# Altium schematic sheet 电机控制盒.SchDoc
size A4; SheetNumber: 4
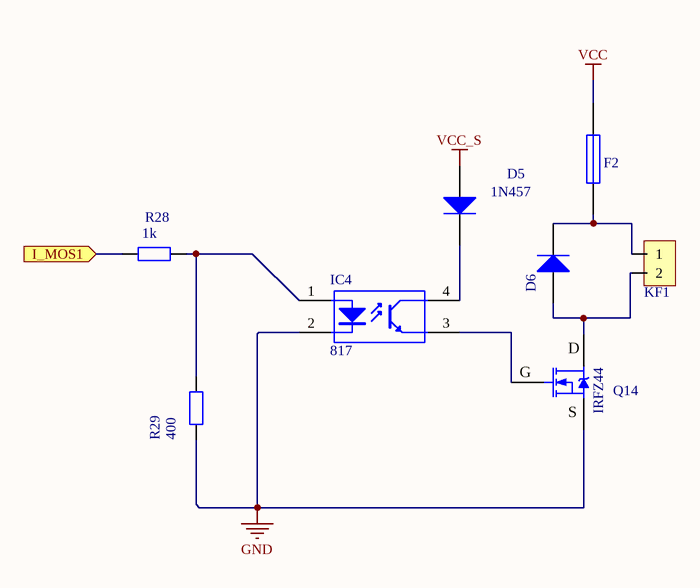
[diagram p0: 电机控制盒.SchDoc]

## Parts
D5  1N457  [DO-35]
D6  1N4007-E3/73  [DO-41]  (value not drawn)
F2  R30-600  [FUSE-16R5X3RX24R9-TH]  (value not drawn)
IC4  817  [DIP4-300]
KF1  KF301-5.08-2p  [KF301-5.0-2P]  (value not drawn)
Q14  IRFZ44  [TO220A]
R28  1k  [RY0R25W]
R29  400  [RY0R25W]

## Ports
I_MOS1 (in)

## Nets
GND: IC4.2(K) Q14.3(S) R29.1
VCC: F2.2
VCC_S: D5.1
I_MOS1: R28.1 ; port I_MOS1
NetD5_2: D5.2 IC4.4(C)
NetD6_1: D6.1 KF1.2 Q14.2(D)
NetD6_2: D6.2 F2.1 KF1.1
NetIC4_1: IC4.1(A) R28.2 R29.2
NetIC4_3: IC4.3(E) Q14.1(G)

## Library data of the parts
D5 = 102DG-00002AI.01: DIP,D0-35,额定电压70V,电流200mA; Allow Altenative Part: Y; serial number: 8; Categories: 二极管; Rated Voltage: 70V; Rated Current: 200mA; COMPONENTLINK 1 DESCRIPTION: GetDatasheet; Remark: Verified by CRD（张宗良） check list V1.0; Modify time: 2015年07月10号; Approved: YES; Part Number: 102DG-00002AI.01; Category: 普通二极管; Value: 1N457; PACKAGE: Bulk; Mounting Type: ThroughHole; Supplier 1: FAIRCHILD; Supplier Part Number 1: 1N457; Pricing 1: .174; COMPONENTLINK 1 URL: https://www.fairchildsemi.com/datasheets/1N/1N457.pdf; MOQ: 10000
D6 = 102DG-00002BS.01: DIP,DO-41,额定电压1000V,电流1A; Allow Altenative Part: Y; serial number: 32; Categories: 二极管; Rated Voltage: 1000V; Rated Current: 1A; COMPONENTLINK 1 DESCRIPTION: OpenDatasheet; Remark: Verified by CRD（张宗良） check list V1.0; Modify time: 2016年08月22号; Approved: YES; Part Number: 102DG-00002BS.01; Category: 普通二极管; Value: 1N4007-E3/73; PACKAGE: Bulk; Mounting Type: ThroughHole; Supplier 1: Vishay; Supplier Part Number 1: 1N4007-E3/73; Pricing 1: .33; COMPONENTLINK 1 URL: http://www.vishay.com/docs/88503/1n4001.pdf; MOQ: 3000
F2 = 102FP-00034BI.01: DIP,16.5x24.9x3.0mm,额定电压30V,额定电流6A,触发电流12A,中速断; Allow Altenative Part: Y; serial number: 3; Categories: 保险丝; Rated Voltage: 30V; Rated Current: 6A; COMPONENTLINK 1 DESCRIPTION: GetDatasheet; Remark: Verified by BU1（黄雄青） check list V1.0; Modify time: 2015年07月10号; Approved: YES; Part Number: 102FP-00034BI.01; Category: 自恢复保险丝; Value: R30-600; PACKAGE: Bulk; Mounting Type: ThroughHole; Supplier 1: SEA&LAND; Supplier Part Number 1: R30-600; Pricing 1: .4; COMPONENTLINK 1 URL: http://www.littelfuse.name/te_product_d_c914/2013-10-18/7630.chtml; MOQ: 500
IC4 = 817: 线性光耦; 版权归属: 源创客; BOM名称: 线性光耦; 学习资源: www.ooocke.com
KF1 = KF301
Q14 = IRF840: N沟场效应管; 版权归属: 源创客; BOM名称: N沟场效应管; 学习资源: www.ooocke.com
R28 R29 = 102RO-00018BW.01: DIP,阻值1M,精度±1%,AXIAL0.4,额定功率1/4W; Allow Altenative Part: Y; serial number: 39; Categories: 电阻; Value: 1M; Tolerance: ±1%; Rated Power: 1/4W; COMPONENTLINK 1 DESCRIPTION: OpenDatasheet; Remark: Verified by BU3（吴明徽）check list V1.0; Modify time: 2015年11月30号; Approved: YES; Part Number: 102RO-00018BW.01; Category: 功率电阻; PACKAGE: Bulk; Mounting Type: ThroughHole; Size: 2.4x6.3mm; Supplier 1: YAGEO; Supplier Part Number 1: MFR-25FTF26-1M; Pricing 1: .08; COMPONENTLINK 1 URL: http://www.yageo.com/documents/recent/Yageo%20LR_MFR_2013.pdf; MOQ: 5000